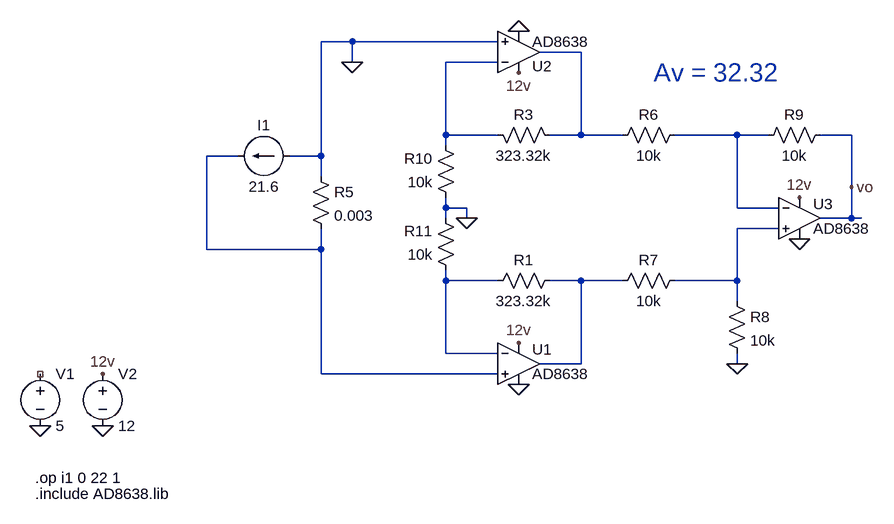
[diagram p0: schematic current-conditioning.asc]
current-conditioning.asc, the LTspice schematic file:
Version 4
SHEET 1 880 732
WIRE -96 -128 -144 -128
WIRE 128 -128 -96 -128
WIRE 256 -112 192 -112
WIRE -96 -96 -96 -128
WIRE 128 -96 48 -96
WIRE 48 16 48 -96
WIRE 128 16 48 16
WIRE 256 16 256 -112
WIRE 256 16 208 16
WIRE 320 16 256 16
WIRE 496 16 400 16
WIRE 544 16 496 16
WIRE 672 16 624 16
WIRE 48 32 48 16
WIRE -272 48 -320 48
WIRE -144 48 -144 -128
WIRE -144 48 -192 48
WIRE -144 80 -144 48
WIRE 672 96 672 16
WIRE 48 128 48 112
WIRE 80 128 48 128
WIRE 496 128 496 16
WIRE 560 128 496 128
WIRE 48 144 48 128
WIRE 80 144 80 128
WIRE 672 144 672 96
WIRE 672 144 624 144
WIRE 688 144 672 144
WIRE 560 160 496 160
WIRE -320 192 -320 48
WIRE -144 192 -144 160
WIRE -144 192 -320 192
WIRE 48 240 48 224
WIRE 128 240 48 240
WIRE 256 240 208 240
WIRE 320 240 256 240
WIRE 496 240 496 160
WIRE 496 240 400 240
WIRE 496 272 496 240
WIRE 48 352 48 240
WIRE 128 352 48 352
WIRE 256 368 256 240
WIRE 256 368 192 368
WIRE 496 368 496 352
WIRE -144 384 -144 192
WIRE 128 384 -144 384
FLAG 160 400 0
FLAG 160 336 12v
FLAG -576 464 0
FLAG -480 464 0
FLAG -480 384 12v
FLAG 160 -144 0
FLAG 160 -80 12v
FLAG 496 368 0
FLAG 592 176 0
FLAG 592 112 12v
FLAG 672 96 vo
FLAG 80 144 0
FLAG -96 -96 0
DATAFLAG 688 144 ""
DATAFLAG -224 192 ""
SYMBOL OpAmps\\UniversalOpAmp 160 368 R0
WINDOW 0 21 -22 Left 2
WINDOW 3 21 16 Left 2
SYMATTR InstName U1
SYMATTR Value AD8638
SYMATTR SpiceModel ""
SYMATTR Value2 ""
SYMATTR SpiceLine ""
SYMBOL res 224 224 R90
WINDOW 0 0 56 VBottom 2
WINDOW 3 32 56 VTop 2
SYMATTR InstName R1
SYMATTR Value 323.32k
SYMBOL voltage -576 368 R0
WINDOW 123 0 0 Left 0
WINDOW 39 0 0 Left 0
SYMATTR InstName V1
SYMATTR Value 5
SYMBOL voltage -480 368 R0
WINDOW 123 0 0 Left 0
WINDOW 39 0 0 Left 0
SYMATTR InstName V2
SYMATTR Value 12
SYMBOL OpAmps\\UniversalOpAmp 160 -112 M180
WINDOW 0 21 -22 Left 2
WINDOW 3 21 16 Left 2
SYMATTR InstName U2
SYMATTR Value AD8638
SYMATTR SpiceModel ""
SYMATTR Value2 ""
SYMATTR SpiceLine ""
SYMBOL res 224 32 M270
WINDOW 0 32 56 VTop 2
WINDOW 3 0 56 VBottom 2
SYMATTR InstName R3
SYMATTR Value 323.32k
SYMBOL res -160 64 R0
SYMATTR InstName R5
SYMATTR Value 0.003
SYMBOL current -192 48 R90
WINDOW 0 -32 40 VBottom 2
WINDOW 3 32 40 VTop 2
SYMATTR InstName I1
SYMATTR Value 21.6
SYMBOL OpAmps\\UniversalOpAmp 592 144 R0
WINDOW 0 21 -22 Left 2
WINDOW 3 21 16 Left 2
SYMATTR InstName U3
SYMATTR Value AD8638
SYMATTR SpiceModel ""
SYMATTR Value2 ""
SYMATTR SpiceLine ""
SYMBOL res 416 0 R90
WINDOW 0 0 56 VBottom 2
WINDOW 3 32 56 VTop 2
SYMATTR InstName R6
SYMATTR Value 10k
SYMBOL res 416 224 R90
WINDOW 0 0 56 VBottom 2
WINDOW 3 32 56 VTop 2
SYMATTR InstName R7
SYMATTR Value 10k
SYMBOL res 480 256 R0
SYMATTR InstName R8
SYMATTR Value 10k
SYMBOL res 640 0 R90
WINDOW 0 0 56 VBottom 2
WINDOW 3 32 56 VTop 2
SYMATTR InstName R9
SYMATTR Value 10k
SYMBOL res 64 128 R180
WINDOW 0 36 76 Left 2
WINDOW 3 36 40 Left 2
SYMATTR InstName R10
SYMATTR Value 10k
SYMBOL res 64 240 R180
WINDOW 0 36 76 Left 2
WINDOW 3 36 40 Left 2
SYMATTR InstName R11
SYMATTR Value 10k
TEXT -584 544 Left 2 !.op i1 0 22 1
TEXT -584 568 Left 2 !.include AD8638.lib
TEXT 368 -80 Left 4 ;Av = 32.32

The netlist it stands for:
* current-conditioning.asc
XU1 N004 N006 12v 0 N007 AD8638  ; pins In+ In- V+ V- OUT
R1 N007 N006 323.32k
V1 NC_01 0 5
V2 12v 0 12
XU2 0 N002 12v 0 N001 AD8638  ; pins In+ In- V+ V- OUT
R3 N001 N002 323.32k
R5 0 N004 0.003
I1 0 N004 21.6
XU3 N005 N003 12v 0 vo AD8638  ; pins In+ In- V+ V- OUT
R6 N003 N001 10k
R7 N005 N007 10k
R8 N005 0 10k
R9 vo N003 10k
R10 0 N002 10k
R11 N006 0 10k
.op i1 0 22 1
.include AD8638.lib
* Av = 32.32
.lib UniversalOpAmp1.lib
.backanno
.end